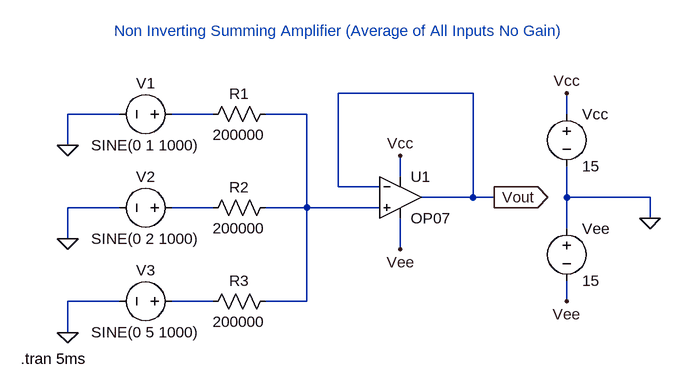
[diagram p0: schematic Assignment 8d.asc]
Assignment 8d.asc, the LTspice schematic file:
Version 4
SHEET 1 880 680
WIRE 320 32 112 32
WIRE -224 64 -304 64
WIRE -80 64 -144 64
WIRE 64 64 0 64
WIRE 464 64 464 32
WIRE -304 112 -304 64
WIRE 208 160 208 128
WIRE 112 176 112 32
WIRE 176 176 112 176
WIRE 320 192 320 32
WIRE 320 192 240 192
WIRE 352 192 320 192
WIRE 464 192 464 144
WIRE 592 192 464 192
WIRE -224 208 -304 208
WIRE -80 208 -144 208
WIRE 64 208 64 64
WIRE 64 208 0 208
WIRE 176 208 64 208
WIRE 592 224 592 192
WIRE 464 240 464 192
WIRE -304 256 -304 208
WIRE 208 272 208 224
WIRE -224 352 -304 352
WIRE -80 352 -144 352
WIRE 64 352 64 208
WIRE 64 352 0 352
WIRE 464 352 464 320
WIRE -304 400 -304 352
FLAG 592 224 0
FLAG 464 32 Vcc
FLAG 208 128 Vcc
FLAG 464 352 Vee
FLAG 208 272 Vee
FLAG 352 192 Vout
IOPIN 352 192 Out
FLAG -304 112 0
FLAG -304 256 0
FLAG -304 400 0
SYMBOL Opamps\\OP07 208 128 R0
SYMATTR InstName U1
SYMBOL voltage 464 48 R0
WINDOW 123 0 0 Left 2
WINDOW 39 0 0 Left 2
SYMATTR InstName Vcc
SYMATTR Value 15
SYMBOL voltage 464 224 R0
WINDOW 123 0 0 Left 2
WINDOW 39 0 0 Left 2
SYMATTR InstName Vee
SYMATTR Value 15
SYMBOL res 16 192 R90
WINDOW 0 0 56 VBottom 2
WINDOW 3 32 56 VTop 2
SYMATTR InstName R2
SYMATTR Value 200000
SYMBOL res 16 48 R90
WINDOW 0 0 56 VBottom 2
WINDOW 3 32 56 VTop 2
SYMATTR InstName R1
SYMATTR Value 200000
SYMBOL res 16 336 R90
WINDOW 0 0 56 VBottom 2
WINDOW 3 32 56 VTop 2
SYMATTR InstName R3
SYMATTR Value 200000
SYMBOL voltage -128 64 R90
WINDOW 0 -32 56 VBottom 2
WINDOW 3 32 56 VTop 2
WINDOW 123 0 0 Left 2
WINDOW 39 0 0 Left 2
SYMATTR InstName V1
SYMATTR Value SINE(0 1 1000)
SYMBOL voltage -128 208 R90
WINDOW 0 -32 56 VBottom 2
WINDOW 3 32 56 VTop 2
WINDOW 123 0 0 Left 2
WINDOW 39 0 0 Left 2
SYMATTR InstName V2
SYMATTR Value SINE(0 2 1000)
SYMBOL voltage -128 352 R90
WINDOW 0 -32 56 VBottom 2
WINDOW 3 32 56 VTop 2
WINDOW 123 0 0 Left 2
WINDOW 39 0 0 Left 2
SYMATTR InstName V3
SYMATTR Value SINE(0 5 1000)
TEXT -232 -64 Left 2 ;Non Inverting Summing Amplifier (Average of All Inputs No Gain)
TEXT -376 440 Left 2 !.tran 5ms

The netlist it stands for:
* Assignment 8d.asc
XU1 N002 Vout Vcc Vee Vout LT1001  ; OP07, pins In+ In- V+ V- OUT
Vcc Vcc 0 15
Vee 0 Vee 15
R2 N002 N003 200000
R1 N002 N001 200000
R3 N002 N004 200000
V1 N001 0 SINE(0 1 1000)
V2 N003 0 SINE(0 2 1000)
V3 N004 0 SINE(0 5 1000)
* Non Inverting Summing Amplifier (Average of All Inputs No Gain)
.tran 5ms
.lib LTC.lib
.backanno
.end